# Altium schematic sheet STM3205P_VoltageMeasure.SchDoc
size A3; Organization: Canis Tech; Address1: -; Address2: -; Address3: -; Address4: Indaiatuba/SP; DocumentNumber: 6; SheetNumber: 6; SheetTotal: 9; Address5: Brazil
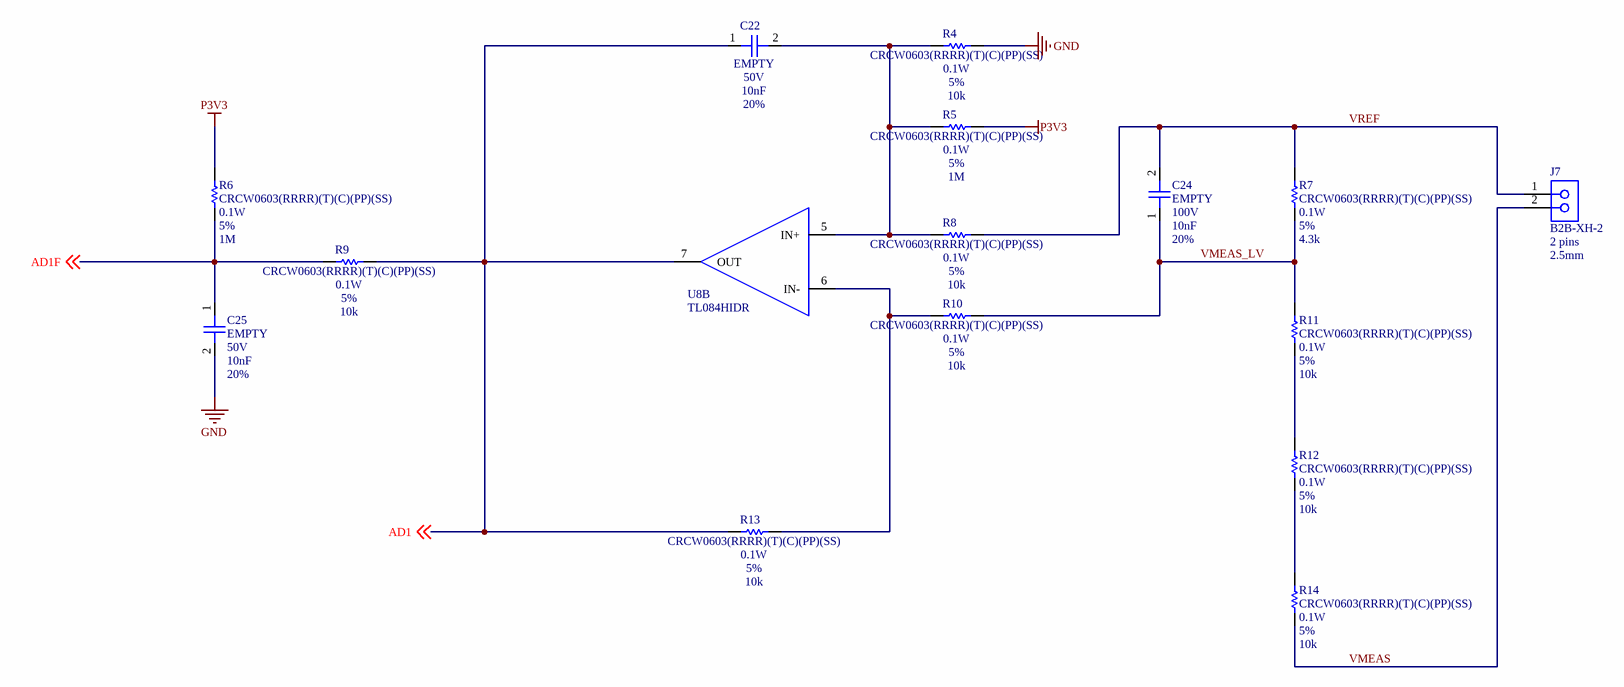
[diagram p0: STM3205P_VoltageMeasure.SchDoc]

## Parts
C22  value 10nF  PartNumber1: EMPTY  Voltage: 50V  Tolerance: 20%  [CAP0603]  (hidden comment: CC0603)
C24  value 10nF  PartNumber1: EMPTY  Voltage: 100V  Tolerance: 20%  [CAP0603]  (hidden comment: CC0603)
C25  value 10nF  PartNumber1: EMPTY  Voltage: 50V  Tolerance: 20%  [CAP0603]  (hidden comment: CC0603)
J7  Pins: 2 pins  Pitch: 2.5mm  [CONXH02STRMALE_2.5]  (hidden comment: B2B-XH-2)
R4  value 10k  PartNumber1: CRCW0603(RRRR)(T)(C)(PP)(SS)  Power: 0.1W  Tolerance: 5%  [RES0603]  (hidden comment: Chip Resistor)
R5  value 1M  PartNumber1: CRCW0603(RRRR)(T)(C)(PP)(SS)  Power: 0.1W  Tolerance: 5%  [RES0603]  (hidden comment: Chip Resistor)
R6  value 1M  PartNumber1: CRCW0603(RRRR)(T)(C)(PP)(SS)  Power: 0.1W  Tolerance: 5%  [RES0603]  (hidden comment: Chip Resistor)
R7  value 4.3k  PartNumber1: CRCW0603(RRRR)(T)(C)(PP)(SS)  Power: 0.1W  Tolerance: 5%  [RES0603]  (hidden comment: Chip Resistor)
R8  value 10k  PartNumber1: CRCW0603(RRRR)(T)(C)(PP)(SS)  Power: 0.1W  Tolerance: 5%  [RES0603]  (hidden comment: Chip Resistor)
R9  value 10k  PartNumber1: CRCW0603(RRRR)(T)(C)(PP)(SS)  Power: 0.1W  Tolerance: 5%  [RES0603]  (hidden comment: Chip Resistor)
R10  value 10k  PartNumber1: CRCW0603(RRRR)(T)(C)(PP)(SS)  Power: 0.1W  Tolerance: 5%  [RES0603]  (hidden comment: Chip Resistor)
R11  value 10k  PartNumber1: CRCW0603(RRRR)(T)(C)(PP)(SS)  Power: 0.1W  Tolerance: 5%  [RES0603]  (hidden comment: Chip Resistor)
R12  value 10k  PartNumber1: CRCW0603(RRRR)(T)(C)(PP)(SS)  Power: 0.1W  Tolerance: 5%  [RES0603]  (hidden comment: Chip Resistor)
R13  value 10k  PartNumber1: CRCW0603(RRRR)(T)(C)(PP)(SS)  Power: 0.1W  Tolerance: 5%  [RES0603]  (hidden comment: Chip Resistor)
R14  value 10k  PartNumber1: CRCW0603(RRRR)(T)(C)(PP)(SS)  Power: 0.1W  Tolerance: 5%  [RES0603]  (hidden comment: Chip Resistor)
U8  TL084HIDR  [SOIC-14-3.9mm]  (part B of 4)

## Nets
GND: C25.2 R4.2
P3V3: R5.2 R6.2
AD1: C22.1 R9.2 R13.1 U8.7(OUT) ; off-sheet AD1
AD1F: C25.1 R6.1 R9.1 ; off-sheet AD1F
VMEAS: J7.2 R14.2
VMEAS_LV: C24.1 R7.2 R10.2 R11.1
VREF: C24.2 J7.1 R7.1 R8.2
NetC22_2: C22.2 R4.1 R5.1 R8.1 U8.5(IN+)
NetR10_1: R10.1 R13.2 U8.6(IN-)
NetR11_2: R11.2 R12.1
NetR12_2: R12.2 R14.1

## Notes on the sheet
- Title
- Author
- Checked By
- Variant
- Size:
- Revision:
- A3
- Date:
- Project
- Time:
- Sheet
- of
- File:

## Library data of the parts
C22 C24 C25 = CC0603: Surface Mount Multilayer Ceramic Chip Capacitors  for Commercial Applications; Manufacturer1: Yageo; Published: 19-Jun-2016; LatestRevisionDate: 19-Jun-2016; Publisher: Lucas Moraes; PackageReference: CAP0603; PackageDescription: CAP0603;2 Leads
J7 = B2B-XH-2: XH Connector 2 POS HDR VERT 2.5mm; Manufacturer1: JST; LastRevisionNote: Created; Gender: Male; Published: 04-Oct-2025; LatestRevisionDate: 04-Oct-2025; PackageReference: CONXH02STRMALE_2.5; Publisher: Lucas Moraes; PackageDescription: CONXH02STRMALE_2.5; 2 Leads; Type: Pin; PartNumber1: B2B-XH-2
R4-R14 = CRCW0603: Thick Film Chip Resistors with CECC Approval,  available with Established Reliability; Manufacturer1: Vishay; LatestRevisionDate: 06-May-2016; PackageReference: 0603; Publisher: Lucas Moraes; PackageDescription: SMD 0603; 2 Leads; Published: 06-May-2016
U8 = TL084HIDR: Quad Operational Amplifiers RRIO; Manufacturer1: Texas Instruments; Published: 27-Aug-2025; LatestRevisionDate: 27-Aug-2025; LatestRevisionNote: Created; PackageReference: SOIC14; Publisher: Lucas Moraes; PackageDescription: SOIC14; 14 Leads; Datasheet: https://www.ti.com/lit/ds/symlink/tl084.pdf; PartNumber1: TL084HIDR